# EAGLE board gf12_v2 (EAGLE 9.5.2)
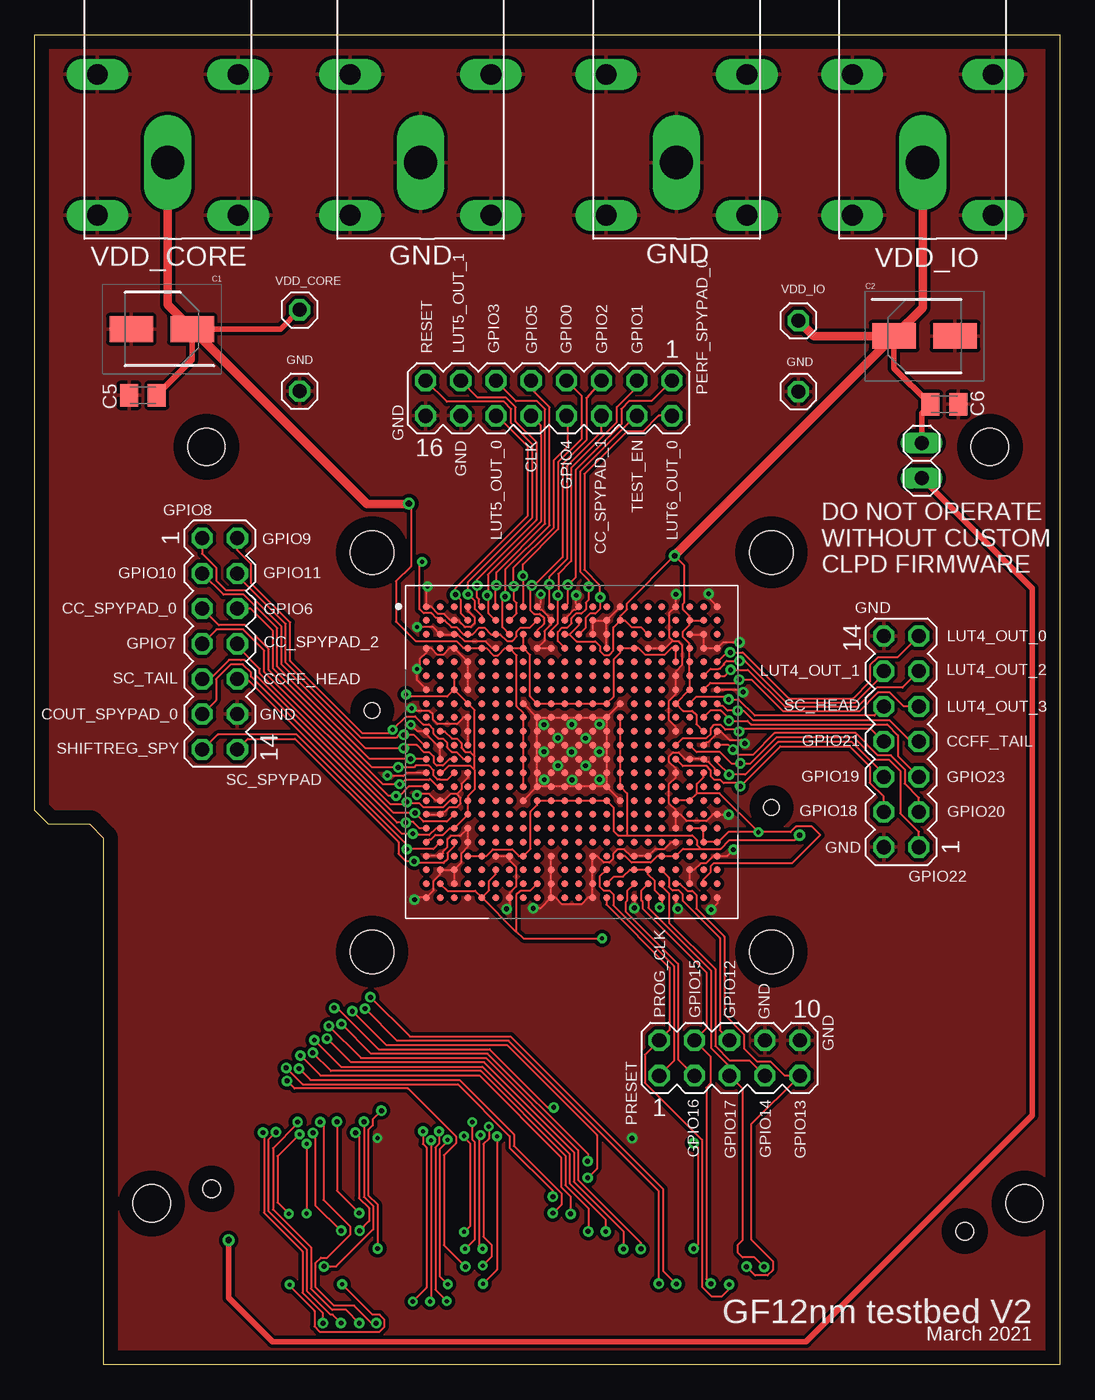
[diagram p3: board, top side]
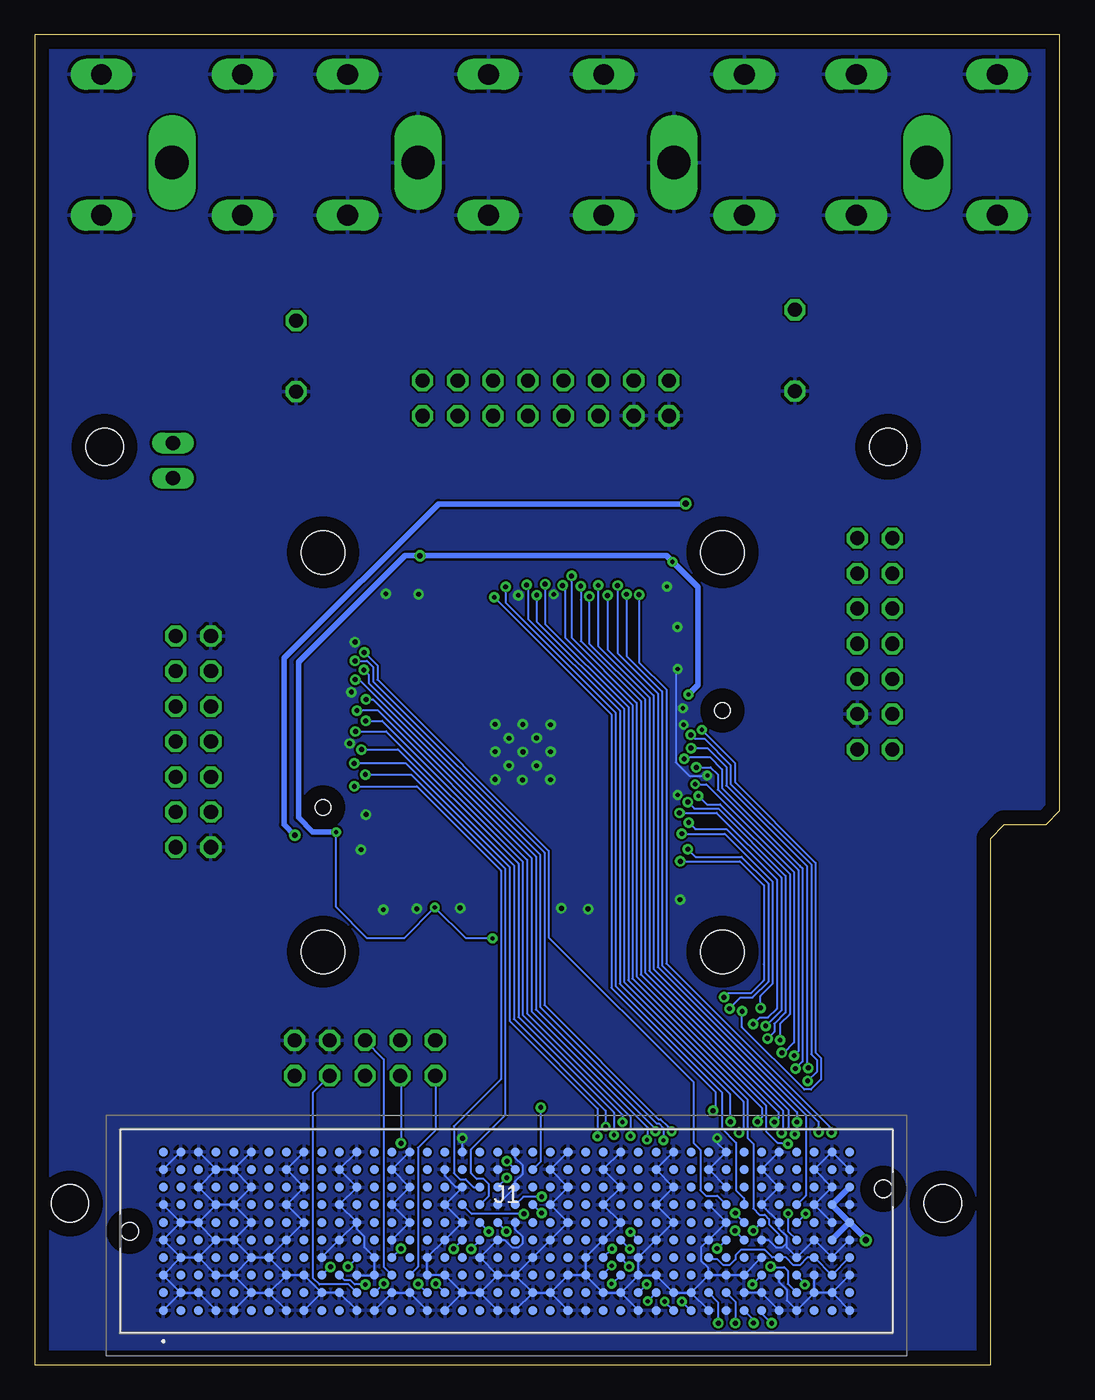
[diagram p4: board, bottom side, seen from below]

Size 74 x 96 mm. Coordinates in mm from the lower left corner, seen from the top.
Outline: 5,0 5,38 4,39 1,39 0,40 0,96 74,96 74,0 5,0
Copper layers (1*16): Top 0.035mm / dielectric 1.5mm / Bottom 0.035mm
Design rules "default *": minimum track width 6mil, minimum drill 0.3mm, track to track 6mil, track to pad 6mil, pad to pad 6mil, via to via 6mil, smd to smd 6mil, copper to edge 40mil, drill to drill 6mil, minimum pad ring 8mil, minimum via ring 8mil, stop-mask expansion 4mil, vias tented up to drill 0mil, thermal gap 10mil
Holes 2.7 mm at 8.45,11.65 71.45,11.65 68.95,66.25 12.4,66.25
Holes 3.15 mm at 24.36,58.63 24.36,29.82 53.19,58.63 53.19,29.82
Holes 1.12 mm at 24.36,47.23 53.19,40.23

## Footprints (pad centres in the part's own frame; a part is rotated, then mirrored left to right if it is on the bottom)
CAPAE530X610N = smd 3.15 x 1.85: 1 -2.2,0; 2 2.2,0
C0805K = smd 1.3 x 1.6: 1 -1,0; 2 1,0
1X01 = drill 1.016 octagon: 1 0,0
ASP13448801 = smd 0.64 x 0.64: A1 24.765,5.715; A2 23.495,5.715; A3 22.225,5.715; A4 20.955,5.715; A5 19.685,5.715; A6 18.415,5.715; A7 17.145,5.715; A8 15.875,5.715; A9 14.605,5.715; A10 13.335,5.715; A11 12.065,5.715; A12 10.795,5.715; A13 9.525,5.715; A14 8.255,5.715; A15 6.985,5.715; A16 5.715,5.715; A17 4.445,5.715; A18 3.175,5.715; A19 1.905,5.715; A20 0.635,5.715; A21 -0.635,5.715; A22 -1.905,5.715; A23 -3.175,5.715; A24 -4.445,5.715; A25 -5.715,5.715; A26 -6.985,5.715; A27 -8.255,5.715; A28 -9.525,5.715; A29 -10.795,5.715; A30 -12.065,5.715; A31 -13.335,5.715; A32 -14.605,5.715; A33 -15.875,5.715; A34 -17.145,5.715; A35 -18.415,5.715; A36 -19.685,5.715; A37 -20.955,5.715; A38 -22.225,5.715; A39 -23.495,5.715; A40 -24.765,5.715; B1 24.765,4.445; B2 23.495,4.445; B3 22.225,4.445; B4 20.955,4.445; B5 19.685,4.445; B6 18.415,4.445; B7 17.145,4.445; B8 15.875,4.445; B9 14.605,4.445; B10 13.335,4.445; B11 12.065,4.445; B12 10.795,4.445; B13 9.525,4.445; B14 8.255,4.445; B15 6.985,4.445; B16 5.715,4.445; B17 4.445,4.445; B18 3.175,4.445; B19 1.905,4.445; B20 0.635,4.445; B21 -0.635,4.445; B22 -1.905,4.445; B23 -3.175,4.445; B24 -4.445,4.445; B25 -5.715,4.445; B26 -6.985,4.445; B27 -8.255,4.445; B28 -9.525,4.445; B29 -10.795,4.445; B30 -12.065,4.445; B31 -13.335,4.445; B32 -14.605,4.445; B33 -15.875,4.445; B34 -17.145,4.445; B35 -18.415,4.445; B36 -19.685,4.445; B37 -20.955,4.445; B38 -22.225,4.445; B39 -23.495,4.445; B40 -24.765,4.445; C1 24.765,3.175; C2 23.495,3.175; C3 22.225,3.175; C4 20.955,3.175; C5 19.685,3.175; C6 18.415,3.175; C7 17.145,3.175; C8 15.875,3.175; C9 14.605,3.175; C10 13.335,3.175; C11 12.065,3.175; C12 10.795,3.175; C13 9.525,3.175; C14 8.255,3.175; C15 6.985,3.175; C16 5.715,3.175; C17 4.445,3.175; C18 3.175,3.175; C19 1.905,3.175; C20 0.635,3.175; C21 -0.635,3.175; C22 -1.905,3.175; C23 -3.175,3.175; C24 -4.445,3.175; C25 -5.715,3.175; C26 -6.985,3.175; C27 -8.255,3.175; C28 -9.525,3.175; C29 -10.795,3.175; C30 -12.065,3.175; C31 -13.335,3.175; C32 -14.605,3.175; C33 -15.875,3.175; C34 -17.145,3.175; C35 -18.415,3.175; C36 -19.685,3.175; C37 -20.955,3.175; C38 -22.225,3.175; C39 -23.495,3.175; C40 -24.765,3.175; D1 24.765,1.905; D2 23.495,1.905; D3 22.225,1.905; D4 20.955,1.905; D5 19.685,1.905; D6 18.415,1.905; D7 17.145,1.905; D8 15.875,1.905; D9 14.605,1.905; D10 13.335,1.905; D11 12.065,1.905; D12 10.795,1.905; D13 9.525,1.905; D14 8.255,1.905; D15 6.985,1.905; D16 5.715,1.905; D17 4.445,1.905; D18 3.175,1.905; D19 1.905,1.905; D20 0.635,1.905; D21 -0.635,1.905; D22 -1.905,1.905; D23 -3.175,1.905; D24 -4.445,1.905; D25 -5.715,1.905; D26 -6.985,1.905; D27 -8.255,1.905; D28 -9.525,1.905; D29 -10.795,1.905; D30 -12.065,1.905; D31 -13.335,1.905; D32 -14.605,1.905; D33 -15.875,1.905; D34 -17.145,1.905; D35 -18.415,1.905; D36 -19.685,1.905; D37 -20.955,1.905; D38 -22.225,1.905; D39 -23.495,1.905; D40 -24.765,1.905; E1 24.765,0.635; E2 23.495,0.635; E3 22.225,0.635; E4 20.955,0.635; E5 19.685,0.635; E6 18.415,0.635; E7 17.145,0.635; E8 15.875,0.635; E9 14.605,0.635; E10 13.335,0.635; E11 12.065,0.635; E12 10.795,0.635; E13 9.525,0.635; E14 8.255,0.635; E15 6.985,0.635; E16 5.715,0.635; E17 4.445,0.635; E18 3.175,0.635; E19 1.905,0.635; E20 0.635,0.635; E21 -0.635,0.635; E22 -1.905,0.635; E23 -3.175,0.635; E24 -4.445,0.635; E25 -5.715,0.635; E26 -6.985,0.635; E27 -8.255,0.635; E28 -9.525,0.635; E29 -10.795,0.635; E30 -12.065,0.635; E31 -13.335,0.635; E32 -14.605,0.635; E33 -15.875,0.635; E34 -17.145,0.635; E35 -18.415,0.635; E36 -19.685,0.635; E37 -20.955,0.635; E38 -22.225,0.635; E39 -23.495,0.635; E40 -24.765,0.635; F1 24.765,-0.635; F2 23.495,-0.635; F3 22.225,-0.635; F4 20.955,-0.635; F5 19.685,-0.635; F6 18.415,-0.635; F7 17.145,-0.635; F8 15.875,-0.635; F9 14.605,-0.635; F10 13.335,-0.635; F11 12.065,-0.635; F12 10.795,-0.635; F13 9.525,-0.635; F14 8.255,-0.635; F15 6.985,-0.635; F16 5.715,-0.635; F17 4.445,-0.635; F18 3.175,-0.635; F19 1.905,-0.635; F20 0.635,-0.635; F21 -0.635,-0.635; F22 -1.905,-0.635; F23 -3.175,-0.635; F24 -4.445,-0.635; F25 -5.715,-0.635; F26 -6.985,-0.635; F27 -8.255,-0.635; F28 -9.525,-0.635; F29 -10.795,-0.635; F30 -12.065,-0.635; F31 -13.335,-0.635; F32 -14.605,-0.635; F33 -15.875,-0.635; F34 -17.145,-0.635; F35 -18.415,-0.635; F36 -19.685,-0.635; F37 -20.955,-0.635; F38 -22.225,-0.635; F39 -23.495,-0.635; F40 -24.765,-0.635; G1 24.765,-1.905; G2 23.495,-1.905; G3 22.225,-1.905; G4 20.955,-1.905; G5 19.685,-1.905; G6 18.415,-1.905; G7 17.145,-1.905; G8 15.875,-1.905; G9 14.605,-1.905; G10 13.335,-1.905; G11 12.065,-1.905; G12 10.795,-1.905; G13 9.525,-1.905; G14 8.255,-1.905; G15 6.985,-1.905; G16 5.715,-1.905; G17 4.445,-1.905; G18 3.175,-1.905; G19 1.905,-1.905; G20 0.635,-1.905; G21 -0.635,-1.905; G22 -1.905,-1.905; G23 -3.175,-1.905; G24 -4.445,-1.905; G25 -5.715,-1.905; G26 -6.985,-1.905; G27 -8.255,-1.905; G28 -9.525,-1.905; G29 -10.795,-1.905; G30 -12.065,-1.905; G31 -13.335,-1.905; G32 -14.605,-1.905; G33 -15.875,-1.905; G34 -17.145,-1.905; G35 -18.415,-1.905; G36 -19.685,-1.905; G37 -20.955,-1.905; G38 -22.225,-1.905; G39 -23.495,-1.905; G40 -24.765,-1.905; H1 24.765,-3.175; H2 23.495,-3.175; H3 22.225,-3.175; H4 20.955,-3.175; H5 19.685,-3.175; H6 18.415,-3.175; H7 17.145,-3.175; H8 15.875,-3.175; H9 14.605,-3.175; H10 13.335,-3.175; H11 12.065,-3.175; H12 10.795,-3.175; H13 9.525,-3.175; H14 8.255,-3.175; H15 6.985,-3.175; H16 5.715,-3.175; H17 4.445,-3.175; H18 3.175,-3.175; H19 1.905,-3.175; H20 0.635,-3.175; H21 -0.635,-3.175; H22 -1.905,-3.175; H23 -3.175,-3.175; H24 -4.445,-3.175; H25 -5.715,-3.175; H26 -6.985,-3.175; H27 -8.255,-3.175; H28 -9.525,-3.175; H29 -10.795,-3.175; H30 -12.065,-3.175; H31 -13.335,-3.175; H32 -14.605,-3.175; H33 -15.875,-3.175; H34 -17.145,-3.175; H35 -18.415,-3.175; H36 -19.685,-3.175; H37 -20.955,-3.175; H38 -22.225,-3.175; H39 -23.495,-3.175; H40 -24.765,-3.175; J1 24.765,-4.445; J2 23.495,-4.445; J3 22.225,-4.445; J4 20.955,-4.445; J5 19.685,-4.445; J6 18.415,-4.445; J7 17.145,-4.445; J8 15.875,-4.445; J9 14.605,-4.445; J10 13.335,-4.445; J11 12.065,-4.445; J12 10.795,-4.445; J13 9.525,-4.445; J14 8.255,-4.445; J15 6.985,-4.445; J16 5.715,-4.445; J17 4.445,-4.445; J18 3.175,-4.445; J19 1.905,-4.445; J20 0.635,-4.445; J21 -0.635,-4.445; J22 -1.905,-4.445; J23 -3.175,-4.445; J24 -4.445,-4.445; J25 -5.715,-4.445; J26 -6.985,-4.445; J27 -8.255,-4.445; J28 -9.525,-4.445; J29 -10.795,-4.445; J30 -12.065,-4.445; J31 -13.335,-4.445; J32 -14.605,-4.445; J33 -15.875,-4.445; J34 -17.145,-4.445; J35 -18.415,-4.445; J36 -19.685,-4.445; J37 -20.955,-4.445; J38 -22.225,-4.445; J39 -23.495,-4.445; J40 -24.765,-4.445; K1 24.765,-5.715; K2 23.495,-5.715; K3 22.225,-5.715; K4 20.955,-5.715; K5 19.685,-5.715; K6 18.415,-5.715; K7 17.145,-5.715; K8 15.875,-5.715; K9 14.605,-5.715; K10 13.335,-5.715; K11 12.065,-5.715; K12 10.795,-5.715; K13 9.525,-5.715; K14 8.255,-5.715; K15 6.985,-5.715; K16 5.715,-5.715; K17 4.445,-5.715; K18 3.175,-5.715; K19 1.905,-5.715; K20 0.635,-5.715; K21 -0.635,-5.715; K22 -1.905,-5.715; K23 -3.175,-5.715; K24 -4.445,-5.715; K25 -5.715,-5.715; K26 -6.985,-5.715; K27 -8.255,-5.715; K28 -9.525,-5.715; K29 -10.795,-5.715; K30 -12.065,-5.715; K31 -13.335,-5.715; K32 -14.605,-5.715; K33 -15.875,-5.715; K34 -17.145,-5.715; K35 -18.415,-5.715; K36 -19.685,-5.715; K37 -20.955,-5.715; K38 -22.225,-5.715; K39 -23.495,-5.715; K40 -24.765,-5.715 | hole 1.27: 27.189,0; -27.191,-3.05
1X02 = drill 1.016 long: 1 -1.27,0; 2 1.27,0
MA08-2 = drill 1.016 octagon: 1 -8.89,-1.27; 2 -8.89,1.27; 3 -6.35,-1.27; 4 -6.35,1.27; 5 -3.81,-1.27; 6 -3.81,1.27; 7 -1.27,-1.27; 8 -1.27,1.27; 9 1.27,-1.27; 10 1.27,1.27; 11 3.81,-1.27; 12 3.81,1.27; 13 6.35,-1.27; 14 6.35,1.27; 15 8.89,-1.27; 16 8.89,1.27
MA07-2 = drill 1.016 octagon: 1 -7.62,-1.27; 2 -7.62,1.27; 3 -5.08,-1.27; 4 -5.08,1.27; 5 -2.54,-1.27; 6 -2.54,1.27; 7 0,-1.27; 8 0,1.27; 9 2.54,-1.27; 10 2.54,1.27; 11 5.08,-1.27; 12 5.08,1.27; 13 7.62,-1.27; 14 7.62,1.27
MA05-2 = drill 1.016 octagon: 1 -5.08,-1.27; 2 -5.08,1.27; 3 -2.54,-1.27; 4 -2.54,1.27; 5 0,-1.27; 6 0,1.27; 7 2.54,-1.27; 8 2.54,1.27; 9 5.08,-1.27; 10 5.08,1.27
BGA484C100P22X22_2400X2400X220N = smd 0.5 x 0.5: A1 -10.5,10.5; A2 -9.5,10.5; A3 -8.5,10.5; A4 -7.5,10.5; A5 -6.5,10.5; A6 -5.5,10.5; A7 -4.5,10.5; A8 -3.5,10.5; A9 -2.5,10.5; A10 -1.5,10.5; A11 -0.5,10.5; A12 0.5,10.5; A13 1.5,10.5; A14 2.5,10.5; A15 3.5,10.5; A16 4.5,10.5; A17 5.5,10.5; A18 6.5,10.5; A19 7.5,10.5; A20 8.5,10.5; A21 9.5,10.5; A22 10.5,10.5; AA1 -10.5,-9.5; AA2 -9.5,-9.5; AA3 -8.5,-9.5; AA4 -7.5,-9.5; AA5 -6.5,-9.5; AA6 -5.5,-9.5; AA7 -4.5,-9.5; AA8 -3.5,-9.5; AA9 -2.5,-9.5; AA10 -1.5,-9.5; AA11 -0.5,-9.5; AA12 0.5,-9.5; AA13 1.5,-9.5; AA14 2.5,-9.5; AA15 3.5,-9.5; AA16 4.5,-9.5; AA17 5.5,-9.5; AA18 6.5,-9.5; AA19 7.5,-9.5; AA20 8.5,-9.5; AA21 9.5,-9.5; AA22 10.5,-9.5; AB1 -10.5,-10.5; AB2 -9.5,-10.5; AB3 -8.5,-10.5; AB4 -7.5,-10.5; AB5 -6.5,-10.5; AB6 -5.5,-10.5; AB7 -4.5,-10.5; AB8 -3.5,-10.5; AB9 -2.5,-10.5; AB10 -1.5,-10.5; AB11 -0.5,-10.5; AB12 0.5,-10.5; AB13 1.5,-10.5; AB14 2.5,-10.5; AB15 3.5,-10.5; AB16 4.5,-10.5; AB17 5.5,-10.5; AB18 6.5,-10.5; AB19 7.5,-10.5; AB20 8.5,-10.5; AB21 9.5,-10.5; AB22 10.5,-10.5; B1 -10.5,9.5; B2 -9.5,9.5; B3 -8.5,9.5; B4 -7.5,9.5; B5 -6.5,9.5; B6 -5.5,9.5; B7 -4.5,9.5; B8 -3.5,9.5; B9 -2.5,9.5; B10 -1.5,9.5; B11 -0.5,9.5; B12 0.5,9.5; B13 1.5,9.5; B14 2.5,9.5; B15 3.5,9.5; B16 4.5,9.5; B17 5.5,9.5; B18 6.5,9.5; B19 7.5,9.5; B20 8.5,9.5; B21 9.5,9.5; B22 10.5,9.5; C1 -10.5,8.5; C2 -9.5,8.5; C3 -8.5,8.5; C4 -7.5,8.5; C5 -6.5,8.5; C6 -5.5,8.5; C7 -4.5,8.5; C8 -3.5,8.5; C9 -2.5,8.5; C10 -1.5,8.5; C11 -0.5,8.5; C12 0.5,8.5; C13 1.5,8.5; C14 2.5,8.5; C15 3.5,8.5; C16 4.5,8.5; C17 5.5,8.5; C18 6.5,8.5; C19 7.5,8.5; C20 8.5,8.5; C21 9.5,8.5; C22 10.5,8.5; D1 -10.5,7.5; D2 -9.5,7.5; D3 -8.5,7.5; D4 -7.5,7.5; D5 -6.5,7.5; D6 -5.5,7.5; D7 -4.5,7.5; D8 -3.5,7.5; D9 -2.5,7.5; D10 -1.5,7.5; D11 -0.5,7.5; D12 0.5,7.5; D13 1.5,7.5; D14 2.5,7.5; D15 3.5,7.5; D16 4.5,7.5; D17 5.5,7.5; D18 6.5,7.5; D19 7.5,7.5; D20 8.5,7.5; D21 9.5,7.5; D22 10.5,7.5; E1 -10.5,6.5; E2 -9.5,6.5; E3 -8.5,6.5; E4 -7.5,6.5; E5 -6.5,6.5; E6 -5.5,6.5; E7 -4.5,6.5; E8 -3.5,6.5; E9 -2.5,6.5; E10 -1.5,6.5; E11 -0.5,6.5; E12 0.5,6.5; E13 1.5,6.5; E14 2.5,6.5; E15 3.5,6.5; E16 4.5,6.5; E17 5.5,6.5; E18 6.5,6.5; E19 7.5,6.5; E20 8.5,6.5; E21 9.5,6.5; E22 10.5,6.5; F1 -10.5,5.5; F2 -9.5,5.5; F3 -8.5,5.5; F4 -7.5,5.5; F5 -6.5,5.5; F6 -5.5,5.5; F7 -4.5,5.5; F8 -3.5,5.5; F9 -2.5,5.5; F10 -1.5,5.5; F11 -0.5,5.5; F12 0.5,5.5; F13 1.5,5.5; F14 2.5,5.5; F15 3.5,5.5; F16 4.5,5.5; F17 5.5,5.5; F18 6.5,5.5; F19 7.5,5.5; F20 8.5,5.5; F21 9.5,5.5; F22 10.5,5.5; G1 -10.5,4.5; G2 -9.5,4.5; G3 -8.5,4.5; G4 -7.5,4.5; G5 -6.5,4.5; G6 -5.5,4.5; G7 -4.5,4.5; G8 -3.5,4.5; G9 -2.5,4.5; G10 -1.5,4.5; G11 -0.5,4.5; G12 0.5,4.5; G13 1.5,4.5; G14 2.5,4.5; G15 3.5,4.5; G16 4.5,4.5; G17 5.5,4.5; G18 6.5,4.5; G19 7.5,4.5; G20 8.5,4.5; G21 9.5,4.5; G22 10.5,4.5; H1 -10.5,3.5; H2 -9.5,3.5; H3 -8.5,3.5; H4 -7.5,3.5; H5 -6.5,3.5; H6 -5.5,3.5; H7 -4.5,3.5; H8 -3.5,3.5; H9 -2.5,3.5; H10 -1.5,3.5; H11 -0.5,3.5; H12 0.5,3.5; H13 1.5,3.5; H14 2.5,3.5; H15 3.5,3.5; H16 4.5,3.5; H17 5.5,3.5; H18 6.5,3.5; H19 7.5,3.5; H20 8.5,3.5; H21 9.5,3.5; H22 10.5,3.5; J1 -10.5,2.5; J2 -9.5,2.5; J3 -8.5,2.5; J4 -7.5,2.5; J5 -6.5,2.5; J6 -5.5,2.5; J7 -4.5,2.5; J8 -3.5,2.5; J9 -2.5,2.5; J10 -1.5,2.5; J11 -0.5,2.5; J12 0.5,2.5; J13 1.5,2.5; J14 2.5,2.5; J15 3.5,2.5; J16 4.5,2.5; J17 5.5,2.5; J18 6.5,2.5; J19 7.5,2.5; J20 8.5,2.5; J21 9.5,2.5; J22 10.5,2.5; K1 -10.5,1.5; K2 -9.5,1.5; K3 -8.5,1.5; K4 -7.5,1.5; K5 -6.5,1.5; K6 -5.5,1.5; K7 -4.5,1.5; K8 -3.5,1.5; K9 -2.5,1.5; K10 -1.5,1.5; K11 -0.5,1.5; K12 0.5,1.5; K13 1.5,1.5; K14 2.5,1.5; K15 3.5,1.5; K16 4.5,1.5; K17 5.5,1.5; K18 6.5,1.5; K19 7.5,1.5; K20 8.5,1.5; K21 9.5,1.5; K22 10.5,1.5; L1 -10.5,0.5; L2 -9.5,0.5; L3 -8.5,0.5; L4 -7.5,0.5; L5 -6.5,0.5; L6 -5.5,0.5; L7 -4.5,0.5; L8 -3.5,0.5; L9 -2.5,0.5; L10 -1.5,0.5; L11 -0.5,0.5; L12 0.5,0.5; L13 1.5,0.5; L14 2.5,0.5; L15 3.5,0.5; L16 4.5,0.5; L17 5.5,0.5; L18 6.5,0.5; L19 7.5,0.5; L20 8.5,0.5; L21 9.5,0.5; L22 10.5,0.5; M1 -10.5,-0.5; M2 -9.5,-0.5; M3 -8.5,-0.5; M4 -7.5,-0.5; M5 -6.5,-0.5; M6 -5.5,-0.5; M7 -4.5,-0.5; M8 -3.5,-0.5; M9 -2.5,-0.5; M10 -1.5,-0.5; M11 -0.5,-0.5; M12 0.5,-0.5; M13 1.5,-0.5; M14 2.5,-0.5; M15 3.5,-0.5; M16 4.5,-0.5; M17 5.5,-0.5; M18 6.5,-0.5; M19 7.5,-0.5; M20 8.5,-0.5; M21 9.5,-0.5; M22 10.5,-0.5; N1 -10.5,-1.5; N2 -9.5,-1.5; N3 -8.5,-1.5; N4 -7.5,-1.5; N5 -6.5,-1.5; N6 -5.5,-1.5; N7 -4.5,-1.5; N8 -3.5,-1.5; N9 -2.5,-1.5; N10 -1.5,-1.5; N11 -0.5,-1.5; N12 0.5,-1.5; N13 1.5,-1.5; N14 2.5,-1.5; N15 3.5,-1.5; N16 4.5,-1.5; N17 5.5,-1.5; N18 6.5,-1.5; N19 7.5,-1.5; N20 8.5,-1.5; N21 9.5,-1.5; N22 10.5,-1.5; P1 -10.5,-2.5; P2 -9.5,-2.5; P3 -8.5,-2.5; P4 -7.5,-2.5; P5 -6.5,-2.5; P6 -5.5,-2.5; P7 -4.5,-2.5; P8 -3.5,-2.5; P9 -2.5,-2.5; P10 -1.5,-2.5; P11 -0.5,-2.5; P12 0.5,-2.5; P13 1.5,-2.5; P14 2.5,-2.5; P15 3.5,-2.5; P16 4.5,-2.5; P17 5.5,-2.5; P18 6.5,-2.5; P19 7.5,-2.5; P20 8.5,-2.5; P21 9.5,-2.5; P22 10.5,-2.5; R1 -10.5,-3.5; R2 -9.5,-3.5; R3 -8.5,-3.5; R4 -7.5,-3.5; R5 -6.5,-3.5; R6 -5.5,-3.5; R7 -4.5,-3.5; R8 -3.5,-3.5; R9 -2.5,-3.5; R10 -1.5,-3.5; R11 -0.5,-3.5; R12 0.5,-3.5; R13 1.5,-3.5; R14 2.5,-3.5; R15 3.5,-3.5; R16 4.5,-3.5; R17 5.5,-3.5; R18 6.5,-3.5; R19 7.5,-3.5; R20 8.5,-3.5; R21 9.5,-3.5; R22 10.5,-3.5; T1 -10.5,-4.5; T2 -9.5,-4.5; T3 -8.5,-4.5; T4 -7.5,-4.5; T5 -6.5,-4.5; T6 -5.5,-4.5; T7 -4.5,-4.5; T8 -3.5,-4.5; T9 -2.5,-4.5; T10 -1.5,-4.5; T11 -0.5,-4.5; T12 0.5,-4.5; T13 1.5,-4.5; T14 2.5,-4.5; T15 3.5,-4.5; T16 4.5,-4.5; T17 5.5,-4.5; T18 6.5,-4.5; T19 7.5,-4.5; T20 8.5,-4.5; T21 9.5,-4.5; T22 10.5,-4.5; U1 -10.5,-5.5; U2 -9.5,-5.5; U3 -8.5,-5.5; U4 -7.5,-5.5; U5 -6.5,-5.5; U6 -5.5,-5.5; U7 -4.5,-5.5; U8 -3.5,-5.5; U9 -2.5,-5.5; U10 -1.5,-5.5; U11 -0.5,-5.5; U12 0.5,-5.5; U13 1.5,-5.5; U14 2.5,-5.5; U15 3.5,-5.5; U16 4.5,-5.5; U17 5.5,-5.5; U18 6.5,-5.5; U19 7.5,-5.5; U20 8.5,-5.5; U21 9.5,-5.5; U22 10.5,-5.5; V1 -10.5,-6.5; V2 -9.5,-6.5; V3 -8.5,-6.5; V4 -7.5,-6.5; V5 -6.5,-6.5; V6 -5.5,-6.5; V7 -4.5,-6.5; V8 -3.5,-6.5; V9 -2.5,-6.5; V10 -1.5,-6.5; V11 -0.5,-6.5; V12 0.5,-6.5; V13 1.5,-6.5; V14 2.5,-6.5; V15 3.5,-6.5; V16 4.5,-6.5; V17 5.5,-6.5; V18 6.5,-6.5; V19 7.5,-6.5; V20 8.5,-6.5; V21 9.5,-6.5; V22 10.5,-6.5; W1 -10.5,-7.5; W2 -9.5,-7.5; W3 -8.5,-7.5; W4 -7.5,-7.5; W5 -6.5,-7.5; W6 -5.5,-7.5; W7 -4.5,-7.5; W8 -3.5,-7.5; W9 -2.5,-7.5; W10 -1.5,-7.5; W11 -0.5,-7.5; W12 0.5,-7.5; W13 1.5,-7.5; W14 2.5,-7.5; W15 3.5,-7.5; W16 4.5,-7.5; W17 5.5,-7.5; W18 6.5,-7.5; W19 7.5,-7.5; W20 8.5,-7.5; W21 9.5,-7.5; W22 10.5,-7.5; Y1 -10.5,-8.5; Y2 -9.5,-8.5; Y3 -8.5,-8.5; Y4 -7.5,-8.5; Y5 -6.5,-8.5; Y6 -5.5,-8.5; Y7 -4.5,-8.5; Y8 -3.5,-8.5; Y9 -2.5,-8.5; Y10 -1.5,-8.5; Y11 -0.5,-8.5; Y12 0.5,-8.5; Y13 1.5,-8.5; Y14 2.5,-8.5; Y15 3.5,-8.5; Y16 4.5,-8.5; Y17 5.5,-8.5; Y18 6.5,-8.5; Y19 7.5,-8.5; Y20 8.5,-8.5; Y21 9.5,-8.5; Y22 10.5,-8.5
73099 = drill 2.4 long: P$1 6,5.5 | drill 1.5 long: P$2 11.08,11.86; P$3 0.92,11.86; P$4 0.92,1.7; P$5 11.08,1.7

## Placement (x,y rotation side)
C1  APXT160ARA101ME61G  [CAPAE530X610N]  9.18,74.75 180 top
C2  APXT160ARA101ME61G  [CAPAE530X610N]  64.23,74.25 0 top
C5  [C0805K]  7.81,69.97 180 top
C6  [C0805K]  65.66,69.32 0 top
GND  [1X01]  19.13,70.28 90 top
GND_IO  [1X01]  55.13,70.25 90 top
J1  ASP-134488-01  [ASP13448801]  39.95,9.65 180 bottom
JP1  [1X02]  64.02,65.26 90 top
SV1  [MA08-2]  37.11,69.76 180 top
SV2  [MA07-2]  62.55,44.98 90 top
SV3  [MA07-2]  13.36,52.04 270 top
SV4  [MA05-2]  50.16,22.14 0 top
U$2  BGA352  [BGA484C100P22X22_2400X2400X220N]  38.77,44.23 0 top
U$3  BANANA_JACK  [73099]  40.33,81.27 0 top
U$4  BANANA_JACK  [73099]  58.09,81.27 0 top
U$5  BANANA_JACK  [73099]  21.85,81.27 0 top
VDD  BANANA_JACK  [73099]  3.61,81.27 0 top
VDD_CORE  [1X01]  19.13,76.14 90 top
VDD_IO  [1X01]  55.13,75.36 90 top

## Tracks (layer width: path | path; a pad name or v marks a point on that pad's centre or on a via)
3V3_CARRIER
  Bottom 0.152: J1.D40 J1.C39 J1.D38 18.22,7.75 18.77,7.2 19.22,7.2 19.77,7.75 J1.D36 20.76,7.75 21.31,8.29 23.03,8.29 23.42,7.91 23.42,7.61 23.43,7.61 23.85,7.2 24.3,7.2 24.72,7.61 25.21,7.61 J1.D32
12V_CARRIER  (via drill 0.3)
  Top 0.152: v18.4,5.79 18.4,5.69 20.19,3.9 20.19,2.77 20.56,2.4 24.9,2.4 25.26,2.76 25.26,3.26 24.9,3.62 24.39,3.62 v22.2,5.81 v22.2,5.8
  Bottom 0.152: J1.C37 18.4,5.88 v18.4,5.79 | v22.2,5.8 21.54,6.46 J1.C35
B48_L4_N  (via drill 0.35)
  Top 0.152: U$2.C10 37.27,52.99 37.77,53.49 v37.77,55.54 v37.77,55.55 37.8,55.59 37.8,57.09 38.73,58.01 38.73,64.72 42.03,68.02 42.03,69.12 43.46,70.55 SV1.3 | v23.16,16.75 23.42,16.49 23.42,12.03 24.12,11.32 24.12,10.34 24.11,10.34 v23.45,9.68
  Bottom 0.152: v37.77,55.55 37.77,53.66 31.46,47.35 31.46,27.62 22.86,19.01 22.86,17.05 v23.16,16.75 | J1.E34 22.8,9.04 v23.45,9.68
B48_L4_P  (via drill 0.35)
  Top 0.152: U$2.C12 39.78,53.23 39.78,53.92 40.08,54.22 40.47,54.22 40.79,54.54 40.79,55.36 v40.82,55.39 40.82,56.24 39.67,57.39 39.67,64.29 42.75,67.37 43.91,67.37 45.03,68.49 SV1.2 | v25.04,18.34 24.41,17.71 24.41,17.27 24.08,16.94 24.08,12.25 24.73,11.6 24.73,8.4 v24.75,8.39
  Bottom 0.152: v40.82,55.39 32.38,46.95 32.38,27.21 24.88,19.71 24.88,18.5 v25.04,18.34 | v24.75,8.39 24.7,8.39 J1.E33
B48_L9_N  (via drill 0.35)
  Top 0.152: U$2.C7 33.76,53.24 33.76,55.25 v33.96,55.46 33.96,57.39 37.16,60.59 37.16,69.12 35.84,70.44 SV1.9 | v22.13,9.68 22.1,9.68 20.26,11.52 20.26,16.57 v20.09,16.74
  Bottom 0.152: v33.96,55.46 33.97,55.45 33.97,52.08 29.94,48.04 29.94,28.31 20,18.37 20,16.83 v20.09,16.74 | v22.13,9.68 v22.14,9.69 J1.F35
B48_L9_P  (via drill 0.35)
  Top 0.152: U$2.C9 36.27,52.98 36.76,53.47 36.76,53.8 36.75,53.81 36.75,53.92 36.47,54.2 36.08,54.2 36.07,54.2 36.04,54.2 35.77,54.47 35.77,56.13 v35.89,56.25 36.06,56.25 38.1,58.29 38.1,65.01 39.82,66.73 39.82,69.77 SV1.5 | v21.83,17.55 21.83,12.56 v23.43,10.96
  Bottom 0.152: v35.89,56.25 35.71,56.07 35.71,52.49 30.85,47.63 30.85,27.88 21.52,18.55 21.52,17.85 v21.83,17.55 | v23.43,10.96 23.43,10.91 J1.F34
B48_L10_N  (via drill 0.3, 0.35)
  Top 0.152: U$2.A8 35.27,56.93 v35.25,56.93 35.25,57.77 37.79,60.31 37.79,65.16 39.49,66.86 39.49,69.92 SV1.7 | v19.64,15.94 19.64,10.94 v19.62,10.92
  Bottom 0.152: v35.25,56.93 35.25,52.48 30.55,47.78 30.55,28.04 21.22,18.71 21.22,16.87 20.39,16.04 19.73,16.04 v19.64,15.94 | v19.62,10.92 19.62,9.64 J1.E37
B48_L10_P  (via drill 0.35)
  Top 0.152: U$2.A10 37.15,54.85 v37.15,56.34 37.15,56.88 38.41,58.14 38.41,64.86 40.92,67.37 SV1.6
  Bottom 0.152: v37.15,56.34 37.15,53.48 31.16,47.49 31.16,27.76 22.55,19.15 22.55,16.37 22.14,15.96 22.14,11.28 21.69,10.83 21.31,10.83 20.99,10.51 20.99,10.13 20.27,9.4 J1.E36
B48_L12_P  (via drill 0.3, 0.35)
  Top 0.152: U$2.A6 33.27,56.2 v33.33,56.26 33.33,57.19 36.85,60.71 36.85,68.96 36.26,69.55 34.73,69.55 33.3,70.98 SV1.11 | v19.13,16.65 17.54,15.06 17.54,11.72 v18.35,10.91
  Bottom 0.152: v33.33,56.26 33.33,51.87 29.63,48.17 29.63,28.44 19.61,18.41 19.61,17.13 v19.13,16.65 | J1.F37 19,10.27 v18.35,10.91
B64_L1_N  (via drill 0.35)
  Top 0.152: U$2.AB14 41.27,33.72 41.27,33.22 45.83,28.65 45.83,24.16 SV4.2 44.05,22.38 44.05,20.36 48.17,16.24 48.17,5.62 48.83,4.96 49.62,4.96 50.13,5.47 v50.13,5.8
  Bottom 0.152: v50.13,5.8 50.91,5.8 51.21,6.11 51.65,6.11 J1.C11
B64_L1_P  (via drill 0.35)
  Top 0.152: U$2.AB17 44.28,33.72 44.28,32.99 48.82,28.45 48.82,22.88 50.16,21.54 SV4.5 51.1,19.93 51.1,9.02 50.77,8.68 50.77,8.07 51.09,7.75 51.96,7.75 v52.64,7.07
  Bottom 0.152: v52.64,7.07 52.69,7.07 J1.C10
B64_L3_N  (via drill 0.35)
  Top 0.152: U$2.AA19 46.59,34.73 47.11,34.2 47.47,34.2 47.76,33.92 47.76,32.93 49.77,30.92 49.77,25.28 51.2,23.85 51.2,22.85 52.17,21.88 53.14,21.88 54.15,20.87 SV4.9 51.72,17.34 51.72,9.04 53.27,7.49 53.27,6.83 52.9,6.46 52,6.46 v51.38,7.08
  Bottom 0.152: v51.38,7.08 50.74,7.71 J1.D12
B64_L5_N
  Top 0.152: U$2.Y18 45.27,35.66 45.77,35.16 45.77,34.49 46.05,34.23 46.52,34.23 46.76,33.98 46.76,33.5 49.46,30.8 49.46,24.14 50.16,23.44 SV4.6
  Bottom 0.152: SV4.6 48.8,22.05 48.8,7.07 J1.C14
B64_L5_P
  Top 0.152: U$2.Y14 40.78,35.23 40.78,34.52 41.09,34.2 41.52,34.2 41.76,33.96 41.76,33.16 46.14,28.78 46.14,21.93 SV4.1
  Bottom 0.152: SV4.1 45.08,16.92 46.33,15.67 46.33,7.08 J1.C15
B64_L6_P  (via drill 0.35)
  Top 0.152: U$2.AA16 42.76,34.2 42.76,33.48 42.65,33.38 42.65,32.73 46.45,28.94 46.45,22.05 SV4.3 | v47.56,15.99 47.86,15.69 47.86,8.68 v47.56,8.38
  Bottom 0.152: SV4.3 47.57,20.82 v47.57,15.99 v47.56,15.99 | v47.56,8.38 48.2,7.75 J1.D14
B64_L15_N  (via drill 0.35)
  Top 0.152: U$2.M19 46.79,43.21 48.51,43.21 48.79,42.93 48.79,42.49 49.06,42.22 49.49,42.22 49.72,41.99 50.69,41.99 v50.93,41.75 53.82,44.64 58.83,44.64 60.28,43.19 60.28,42.01 61.28,41.01 SV2.4
  Bottom 0.152: v50.93,41.75 46.41,41.75 40.34,35.68 40.34,20.62 43.73,17.23 43.73,13.83 43.3,13.4 42.88,13.4 42.3,12.82 J1.H19
B64_L15_P  (via drill 0.3, 0.35)
  Top 0.152: U$2.M4 30.95,43.73 30.45,44.23 30.12,44.23 30.1,44.25 30.08,44.25 29.8,44.53 29.8,44.55 29.75,44.6 29.75,44.92 29.47,45.2 29.15,45.2 29.13,45.22 29.1,45.25 29.08,45.25 28.8,45.53 28.8,45.55 28.77,45.58 28.77,45.91 28.46,46.22 28.05,46.22 27.47,46.8 26.8,46.8 v25.84,45.84 25.83,45.84 25.56,45.57 23.67,45.57 18.44,50.8 18.44,53.58 15.64,56.38 15.64,57.81 14.63,58.82 SV3.2 | v22.93,25.52 25.38,23.07 34.09,23.07 40.57,16.59 40.57,14.15 v39.92,13.5
  Bottom 0.152: v25.84,45.84 25.84,45.82 23.45,43.43 23.45,42.05 17.64,36.24 17.64,22.54 17.25,22.15 17.25,20.59 17.97,19.87 18.45,19.87 22.93,24.36 v22.93,25.52 | v39.92,13.5 40.59,12.83 J1.H20
B64_L19_N  (via drill 0.35)
  Top 0.152: U$2.M22 49.27,43.45 v50.13,42.6 51.3,42.6 53.65,44.95 58.99,44.95 61.28,42.66 SV2.6
  Bottom 0.152: v50.13,42.6 46.82,42.6 40.02,35.8 40.02,18.02 42.5,15.55 42.5,13.83 42.09,13.42 41.6,13.42 41.2,13.03 41.2,12.21 J1.G19
B64_L19_P  (via drill 0.35)
  Top 0.152: U$2.N3 29.77,42.22 29.27,42.22 29.24,42.25 29.08,42.25 28.8,42.53 28.8,42.91 28.47,43.24 27.48,43.24 27.37,43.13 v26.25,43.13 v26.24,43.12 24.35,43.12 17.21,50.26 17.21,52.97 15.6,54.58 SV3.6 | v19.18,22.32 20.62,20.88 32.09,20.88 38,14.97 38,12.84 38.67,12.17 v38.67,10.89 v38.68,10.89
  Bottom 0.152: v19.18,22.32 18.88,22.62 18.88,35.71 18.89,35.71 24.7,41.52 24.7,42.61 25.21,43.12 v26.24,43.12 | v38.68,10.89 42.46,10.89 J1.G18
B65_L1_N  (via drill 0.35)
  Top 0.152: U$2.A5 32.08,54.92 32.08,55.24 31.93,55.39 v31.93,56.24 31.93,56.69 36.22,60.98 36.22,66.58 34.71,68.09 34.71,69.12 34.01,69.82 31.97,69.82 SV1.13
  Bottom 0.152: v31.93,56.24 31.93,51.36 29.02,48.45 29.02,28.71 18.35,18.04 18.35,12.2 J1.G37
B65_L6_N  (via drill 0.35)
  Top 0.152: U$2.L1 28.27,44.72 28.14,44.72 27.39,45.47 v26.64,45.47 v26.64,45.46 26.28,45.46 26.08,45.26 23.54,45.26 18.12,50.68 18.12,53.47 14.63,56.96 SV3.4 | v18.21,20.49 18.76,19.94 26.95,19.94 30.41,16.48 30.41,16 29.54,15.13 29.54,8.64 v31.1,7.08
  Bottom 0.152: v26.64,45.46 26.37,45.19 25.67,45.19 23.77,43.29 23.77,41.94 17.95,36.12 17.95,22.42 17.55,22.03 17.55,21.14 v18.21,20.49 | J1.D27 31.7,7.68 v31.1,7.08
B65_L6_P  (via drill 0.3, 0.35)
  Top 0.152: U$2.L19 46.77,45.23 48.48,45.23 48.8,45.54 48.8,45.92 49.08,46.2 49.49,46.2 49.84,45.85 50.7,45.85 v50.84,45.71 51.03,45.9 60.36,45.9 SV2.8 | v32.18,16.58 32.07,16.47 32.07,8.62 v32.32,8.37
  Bottom 0.152: v50.84,45.71 48.62,45.71 39.08,36.17 39.08,25.1 32.2,18.22 32.2,16.6 v32.18,16.58 | v32.32,8.37 32.34,8.37 J1.D26
B65_L9_N  (via drill 0.35)
  Top 0.152: U$2.M1 v27.13,43.73 v27.12,43.73 24.18,43.73 17.51,50.4 17.51,53.16 15.09,55.58 13.63,55.58 SV3.3 | v19.08,21.38 19.9,20.56 30.67,20.56 34.59,16.64 34.59,15.8 38.01,12.39 38.01,11.55 v37.41,10.95
  Bottom 0.152: v27.12,43.73 27,43.85 25.26,43.85 24.39,42.98 24.39,41.64 18.76,36.02 18.75,36.02 18.59,35.85 18.57,35.85 18.57,21.89 v19.08,21.38 | v37.41,10.95 38.02,11.55 J1.G22
B65_L9_P  (via drill 0.35)
  Top 0.152: U$2.M3 29.95,43.73 29.48,43.24 29.02,43.24 28.8,43.48 28.8,43.91 28.5,44.21 28.11,44.21 27.6,44.72 26.84,44.72 v26.63,44.51 26.61,44.49 23.87,44.49 17.82,50.55 17.82,53.3 15.22,55.89 13.81,55.89 13.11,56.59 13.11,57.53 12.09,58.55 SV3.1 | v18.16,21.43 19.34,20.25 30.55,20.25 34.29,16.51 34.29,15.68 37.39,12.58 v37.39,12.15 v37.4,12.14
  Bottom 0.152: v26.63,44.51 25.43,44.51 24.08,43.16 24.08,41.81 18.26,35.99 18.26,21.53 v18.16,21.43 | v37.4,12.14 38.73,12.14 J1.G21
B65_L10_N  (via drill 0.3, 0.35)
  Top 0.152: U$2.L20 47.77,44.23 49.47,44.23 50.29,43.41 v50.94,43.41 51.67,43.41 53.52,45.26 59.13,45.26 60.72,43.67 61.68,43.67 62.48,42.87 62.48,39.8 63.82,38.46 SV2.1 | v33.37,16.49 33.37,6.87 v32.35,5.85 v32.35,5.84
  Bottom 0.152: v50.94,43.41 v50.93,43.42 47.21,43.42 39.71,35.92 39.71,24.82 33.37,18.48 v33.37,16.49 | v32.35,5.84 32.33,5.84 J1.C27
B65_L10_P  (via drill 0.3, 0.35)
  Top 0.152: U$2.L22 50.09,44.73 v50.41,44.41 50.79,44.03 51.85,44.03 53.41,45.59 59.26,45.59 60.87,43.98 61.8,43.98 62.8,42.98 62.8,41.95 63.82,40.93 SV2.3 | v32.78,17.19 32.78,16.32 32.39,15.93 32.39,9.26 32.97,8.68 32.97,7.79 v32.35,7.17 v32.35,7.16
  Bottom 0.152: v50.41,44.41 v50.4,44.42 47.78,44.42 39.41,36.05 39.41,24.96 32.78,18.34 v32.78,17.19 | v32.35,7.16 32.97,6.54 J1.C26
B65_L16_N  (via drill 0.35)
  Top 0.152: U$2.D11 37.77,52.23 37.77,52.91 38.06,53.2 38.07,53.2 38.08,53.2 38.45,53.2 38.76,53.51 38.76,53.89 39.07,54.21 39.46,54.21 39.78,54.53 39.78,55.01 40,55.23 v40,56.16 40,56.6 39.36,57.24 39.36,64.45 43.3,68.39 43.36,68.39 SV1.4
  Bottom 0.152: v40,56.16 40,55.01 32.07,47.08 32.07,27.34 24.41,19.68 24.41,17.07 23.38,16.04 23.38,12.6 22.8,12.03 J1.G34
B65_L16_P  (via drill 0.35)
  Top 0.152: U$2.E22 49.97,51.42 v50.21,51.42 51.12,51.42 54.45,48.09 59.09,48.09 60.29,49.3 60.29,50.49 60.86,51.06 62.28,51.06 SV2.13
  Bottom 0.152: v50.21,51.42 50.19,51.42 49.25,50.48 49.25,49.45 36.9,37.09 36.9,30.86 26.45,20.41 26.45,16.01 25.95,15.51 25.95,12.6 25.55,12.21 24.73,12.21 J1.G33
B65_L23_N  (via drill 0.3, 0.35)
  Top 0.152: U$2.H22 49.45,47.55 49.66,47.55 50.01,47.21 v50.75,47.21 51.17,47.21 51.85,46.53 61.68,46.53 63.23,44.98 SV2.7 | v31,16.51 31,16.41 31.43,15.98 31.43,10 31.02,9.59 v31,9.59
  Bottom 0.152: v50.75,47.21 50.72,47.24 49.25,47.24 38.46,36.45 38.46,25.37 31,17.91 v31,16.51 | v31,9.59 J1.E28
B65_L23_P  (via drill 0.3, 0.35)
  Top 0.152: U$2.J21 48.77,47.22 49.53,47.22 50.11,46.64 v50.11,46.47 51.46,46.47 51.71,46.22 61.53,46.22 62.32,45.43 62.32,43.94 SV2.5 | v31.58,17.52 31.58,16.26 31.76,16.08 31.76,9.04 31.07,8.35 v31.05,8.37
  Bottom 0.152: v50.11,46.47 48.92,46.47 38.78,36.33 38.78,25.24 31.58,18.05 v31.58,17.52 | v31.05,8.37 31.7,9.01 J1.E27
B66_L10_N  (via drill 0.35)
  Top 0.152: U$2.U1 27.79,38.73 27.32,39.19 26.84,39.19 v26.79,39.14 26.14,39.14 15.63,49.66 15.63,49.95 15.03,50.55 14.16,50.55 13.09,49.48 13.09,47.96 SV3.11 | v22.14,24.59 24.27,22.46 32.7,22.46 39.92,15.24 v39.92,14.69 v39.91,14.69
  Bottom 0.152: v26.79,39.14 26.31,38.66 24.07,38.66 20.43,35.02 20.43,25.7 21.06,25.07 21.66,25.07 v22.14,24.59 | v39.91,14.69 J1.J21
B66_L10_P  (via drill 0.35)
  Top 0.152: U$2.U2 28.98,38.73 28.48,38.23 27.39,38.23 v27.29,38.33 26.53,38.33 26.52,38.33 15.35,49.5 SV3.10 | v21.61,25.76 21.84,25.76 24.82,22.77 32.84,22.77 37.02,18.58 v37.47,18.58
  Bottom 0.152: v27.29,38.33 24.19,38.33 20.74,34.88 20.74,27.5 21.61,26.62 v21.61,25.76 | v37.47,18.58 v37.48,18.57 37.48,14.66 J1.J22
B66_L15_N  (via drill 0.35)
  Top 0.152: U$2.R3 29.98,40.73 29.49,40.23 28.06,40.23 27.77,40.52 26.96,40.52 v26.86,40.62 26.7,40.46 25.7,40.46 16.25,49.91 16.25,50.23 14.63,51.86 SV3.8 | v21.1,23.55 22.82,21.83 32.44,21.83 38.91,15.35 38.91,13.21 42.51,9.62 v42.51,8.36 v42.5,8.36
  Bottom 0.152: v26.86,40.62 26.38,40.14 24.66,40.14 19.81,35.29 19.81,25.43 20.62,24.62 20.62,24.03 v21.1,23.55 | J1.E19 41.85,9.01 v42.5,8.36
B66_L15_P  (via drill 0.35)
  Top 0.152: U$2.T3 29.76,39.21 28.07,39.21 v27.45,39.83 v27.44,39.84 25.89,39.84 15.94,49.79 15.94,50.07 15.16,50.85 14.88,50.85 14.86,50.87 14.03,50.87 12.66,49.5 SV3.9 | v21.23,24.46 23.54,22.15 32.57,22.15 39.22,15.5 39.22,13.34 43.76,8.8 v43.76,8.37
  Bottom 0.152: v27.45,39.83 24.79,39.83 20.12,35.16 20.12,25.57 v21.23,24.46 | J1.E18 v43.76,8.38 v43.76,8.37
B66_L24_N  (via drill 0.3, 0.35)
  Top 0.152: v20.19,23.43 22.1,21.52 32.32,21.52 38.61,15.23 38.61,13.09 41.21,10.49 v41.21,9.62 v41.22,9.62 | U$2.P1 27,41.73 26.34,41.06 v26.09,41.06 25.54,41.06 16.58,50.02 16.58,51.54 15.05,53.07 13.12,53.07 SV3.7
  Bottom 0.152: v41.22,9.62 41.85,10.26 J1.F19 | v26.09,41.06 25.49,40.46 24.53,40.46 19.5,35.44 19.5,25.31 20.19,24.62 v20.19,23.43
B66_L24_P  (via drill 0.3, 0.35)
  Top 0.152: v20.07,22.52 21.39,21.2 32.2,21.2 38.31,15.1 38.31,12.96 39.96,11.31 v39.96,9.63 v39.95,9.63 | U$2.P2 29.09,41.73 28.54,42.27 28.5,42.27 28.43,42.21 26.74,42.21 26.43,41.9 v26.33,41.9 25.14,41.9 16.89,50.15 16.89,51.66 15.18,53.38 13.29,53.38 SV3.5
  Bottom 0.152: v39.95,9.63 39.95,9.65 J1.F20 | v26.33,41.9 25.52,41.9 19.18,35.57 19.18,23.27 19.93,22.52 v20.07,22.52
B228_TX3_N  (via drill 0.3, 0.35)
  Top 0.152: U$2.F21 48.78,50.23 49.37,50.23 49.39,50.25 49.47,50.25 49.75,50.53 49.75,50.61 49.94,50.8 v50.88,50.8 51.27,50.8 54.3,47.77 59.21,47.77 61.28,49.84 SV2.12 | v28.02,16.84 28.02,15.94 28.29,15.68 28.29,5.57 v27.29,4.57
  Bottom 0.152: v50.88,50.8 50.02,50.8 49.57,50.35 49.57,49.32 37.21,36.97 37.21,25.96 28.98,17.73 28.82,17.73 28.3,17.21 28.3,17.05 28.09,16.84 v28.02,16.84 | v27.29,4.57 26.66,3.94 J1.A31
B228_TX3_P  (via drill 0.3, 0.35)
  Top 0.152: U$2.F22 49.81,49.73 v50.24,50.16 51.48,50.16 54.17,47.47 59.37,47.47 60.78,48.88 62.64,48.88 SV2.11 | v28.61,16.21 28.61,4.65 v28.53,4.57
  Bottom 0.152: v50.24,50.16 49.89,49.8 49.89,49.21 37.52,36.83 37.52,25.84 29.11,17.43 28.95,17.43 28.61,17.09 v28.61,16.21 | v28.53,4.57 J1.A30
B229_RX2_N  (via drill 0.35)
  Top 0.152: U$2.V2 28.78,37.23 v26.87,37.23 v26.86,37.22 26.86,37.56 18.93,45.49 13.21,45.49 12.14,44.42 SV3.13 | v23.84,25.71 26.17,23.38 34.22,23.38 45.04,12.56 v45.04,5.86 v45.05,5.86
  Bottom 0.152: v26.86,37.22 26.31,36.67 22.98,36.67 21.05,34.74 21.05,27.64 22.18,26.51 23.04,26.51 v23.84,25.71 | v45.05,5.86 J1.B17
B229_RX2_P  (via drill 0.35)
  Top 0.152: U$2.V3 30.27,37.41 29.79,36.93 29.79,36.49 29.52,36.22 27.51,36.22 v27.39,36.34 26.8,36.34 26.25,36.89 26.25,37.73 18.8,45.18 15.39,45.18 SV3.14 | v24.24,26.53 27.08,23.69 34.36,23.69 45.35,12.7 45.35,6.8 v46.32,5.83
  Bottom 0.152: v27.39,36.34 23.1,36.34 21.36,34.6 21.36,28.92 21.36,28.91 21.36,27.76 22.31,26.82 23.95,26.82 v24.24,26.53 | v46.32,5.83 45.7,5.21 J1.B16
B229_RX3_N  (via drill 0.35)
  Top 0.152: U$2.AA17 43.77,34.22 43.77,33.53 43.9,33.4 43.9,32.92 48.5,28.32 48.5,24.29 SV4.4 48.78,22.25 48.78,20.3 48.48,20 48.48,6.18 v48.8,5.86
  Bottom 0.152: v48.8,5.86 48.82,5.86 J1.B13
B229_RX3_P
  Top 0.152: U$2.AA18 45.27,34.52 45.8,34.01 45.8,31.91 49.13,28.57 49.13,23.01 50.2,21.95 51.62,21.95 SV4.7
  Bottom 0.152: J1.B12 51.34,5.8 53.45,5.8 53.89,6.24 53.89,19.68 SV4.7
B229_TX0_N  (via drill 0.35)
  Top 0.152: U$2.B4 30.77,54.23 30.77,55.21 30.39,55.59 v30.37,55.59 30.37,56.05 35.57,61.25 35.57,66.32 33.35,68.54 SV1.12 | v20.81,3.01 20.81,3.73 19.34,5.21 19.34,8.19 16.55,10.98 16.55,16.7 v16.49,16.76
  Bottom 0.152: v30.37,55.59 30.37,50.7 28.41,48.74 28.41,28.96 16.61,17.16 16.61,16.88 v16.49,16.76 | J1.A35 21.54,3.73 v20.81,3.01
B229_TX0_P  (via drill 0.35)
  Top 0.152: U$2.B5 32.27,54.03 31.77,54.54 31.77,55.12 v31.28,55.61 31.28,56.49 35.91,61.12 35.91,66.45 34.4,67.96 34.4,68.99 33.89,69.5 29.75,69.5 SV1.15 | v17.42,16.79 16.87,16.24 16.87,11.1 19.64,8.33 19.64,5.35 21.37,3.62 21.51,3.62 v22.11,3.02
  Bottom 0.152: v31.28,55.61 31.28,51.16 28.72,48.6 28.72,28.84 17.42,17.54 v17.42,16.79 | J1.A34 22.11,3.24 v22.11,3.02
B229_TX2_N  (via drill 0.35)
  Top 0.152: U$2.A11 38.47,54.91 38.47,56.27 v38.49,56.29 39.04,56.84 39.04,64.57 42.35,67.88 42.35,68.99 42.94,69.58 44.55,69.58 SV1.1 | v23.77,17.54 23.77,12.12 24.43,11.46 24.43,9.77 21.76,7.1 v20.88,7.1
  Bottom 0.152: v38.49,56.29 38.38,56.18 38.38,53.83 31.77,47.22 31.77,27.5 23.82,19.55 23.82,17.54 v23.77,17.54 | v20.88,7.1 20.88,7.04 19.9,7.04 19.64,6.78 19.64,5.85 J1.B37
B229_TX3_N  (via drill 0.35)
  Top 0.152: U$2.B6 32.76,54.24 32.76,55.42 v32.65,55.52 32.71,55.58 32.71,57.02 36.54,60.85 36.54,67 36.54,67.16 36.54,67.79 SV1.10 | v18.98,17.52 18.98,17.42 17.2,15.64 17.2,11.22 19.95,8.47 19.95,5.49 21.48,3.96 22.48,3.96 v23.43,3.01
  Bottom 0.152: v32.65,55.52 32.65,51.63 29.33,48.31 29.33,28.57 18.98,18.23 v18.98,17.52 | J1.B33 23.41,4.54 23.41,3.02 v23.43,3.01
B229_TX3_P  (via drill 0.35)
  Top 0.152: U$2.B7 34.79,54.24 34.79,54.98 34.57,55.2 v34.57,56.19 v34.58,56.2 34.58,57.55 37.47,60.44 37.47,65.28 38.5,66.31 38.5,68.37 SV1.8 | v20.61,17.52 20.85,17.28 20.85,11.9 22.79,9.96 22.79,9.41 21.12,7.74 20.66,7.74 20.27,7.35 20.27,5.61 21.61,4.27 23.07,4.27 24.33,3.01 v24.65,3.01
  Bottom 0.152: v34.58,56.2 34.58,55.22 34.57,55.21 34.57,52.23 30.24,47.91 30.24,28.17 20.3,18.23 20.3,17.82 v20.61,17.52 | J1.B32 25.34,5.18 24.69,4.53 24.69,3.01 v24.65,3.01
B230_TX0_N  (via drill 0.3, 0.35)
  Top 0.152: U$2.G21 48.77,49.22 50.62,49.22 v50.86,49.46 51.74,49.46 54.04,47.16 59.51,47.16 60.87,48.52 61.73,48.52 62.73,47.52 SV2.9 | v29.19,16.84 29.19,15.95 28.93,15.69 28.93,5.42 v29.75,4.6
  Bottom 0.152: v50.86,49.46 50.59,49.46 37.82,36.69 37.82,25.65 29.19,17.02 v29.19,16.84 | v29.75,4.6 29.16,5.2 J1.B29
B230_TX0_P  (via drill 0.3, 0.35)
  Top 0.152: U$2.H20 47.78,48.23 49.88,48.23 v50.09,48.02 50.81,48.02 51.98,46.85 60.61,46.85 SV2.10 | v29.81,16.25 29.81,16.12 29.24,15.55 29.24,6.39 v29.82,5.81
  Bottom 0.152: v50.09,48.02 49.59,48.02 38.14,36.57 38.14,25.52 29.77,17.16 29.77,16.29 v29.81,16.25 | v29.82,5.81 J1.B28
GND  (via drill 0.3, 0.35)
  Top 0.152: U$2.R8 U$2.P9 | U$2.P9 U$2.N9 U$2.M9 U$2.L9 U$2.K9 U$2.J9 | U$2.J9 U$2.H8 | U$2.J9 U$2.J10 U$2.J11 U$2.J12 U$2.J13 U$2.J14 | U$2.J14 U$2.K14 U$2.L14 U$2.M14 U$2.N14 U$2.P14 | U$2.J14 U$2.H15 | U$2.P14 U$2.R15 | U$2.P14 U$2.P13 U$2.P12 U$2.P11 U$2.P10 U$2.P9 | U$2.D14 U$2.C14 U$2.B14 | U$2.B14 U$2.A15 | U$2.B14 U$2.B13 U$2.C13 | U$2.D17 U$2.D18 45.52,51.73 46,52.2 | 46,52.2 46.47,52.2 46.75,51.92 46.75,50.53 46.27,50.05 U$2.F19 U$2.G19 46.27,48.4 45.8,47.92 45.8,46.53 46.27,46.05 U$2.K19 | U$2.L4 U$2.K4 U$2.J4 30.95,46.73 30.47,46.25 29.08,46.25 28.75,46.57 28.75,46.92 28.47,47.2 27.39,47.2 v27.21,47.38 | U$2.U19 U$2.T19 | U$2.V19 45.95,37.73 45.47,37.25 44.8,37.25 U$2.W17 U$2.W16 43.03,36.73 42.55,37.2 42.08,37.2 41.75,36.88 41.75,36.53 41.47,36.25 41.08,36.25 40.6,36.73 U$2.W13 U$2.Y13 U$2.AA13 U$2.AB13 39.95,33.73 39.47,33.25 38.08,33.25 37.6,33.73 U$2.AB10 | U$2.AB10 U$2.AA10 U$2.Y10 U$2.W10 | U$2.W6 U$2.W7 34.27,36.4 34.75,35.92 34.75,34.53 34.27,34.05 U$2.AB7 34.27,33.12 v34.06,32.9 | U$2.Y3 U$2.Y2 29.27,35.4 28.8,34.92 28.8,34.25 U$2.AB1 27.57,33.73 v27.42,33.57 | U$2.Y3 U$2.AA3 | U$2.Y3 30.8,36.25 30.8,36.92 31.27,37.4 U$2.V4 U$2.U4 30.75,38.2 30.08,38.2 29.8,37.92 29.8,37.37 29.48,37.06 29.48,36.94 U$2.W2 U$2.W1 | U$2.T1 U$2.T2 29.48,39.92 29.62,39.92 29.94,40.25 30.47,40.25 30.75,40.53 30.75,40.92 30.47,41.2 | 30.47,41.2 30.03,41.2 29.55,40.73 U$2.R2 28.95,40.73 28.47,41.2 27.67,41.2 v27.59,41.12 | 30.47,41.2 30.8,41.53 30.8,41.92 31.27,42.4 U$2.N4 | U$2.G4 U$2.F4 U$2.E4 U$2.D3 29.95,51.73 29.47,51.25 29.08,51.25 28.6,51.73 U$2.D1 28.27,51.4 27.8,50.92 27.8,50.43 v27.59,50.22 27.59,49.41 U$2.G1
  Top 0.152: U$2.D6 33.03,51.73 32.55,52.2 31.05,52.2 30.53,52.73 U$2.C3 U$2.C2 28.76,53.24 v27.61,53.24 | U$2.D10 U$2.D9 36.8,52.25 36.8,52.95 37.27,53.43 U$2.B10 37.06,53.94 37.06,54.05 36.6,54.51 36.49,54.51 U$2.A9 36.53,54.98 v36.53,55.61 | U$2.B11 38.45,53.91 38.45,54.02 38.95,54.51 39.06,54.51 U$2.A12 39.09,54.91 v39.09,55.54 | U$2.A4 31.27,54.4 31.75,53.92 31.75,53.53 31.47,53.25 31.08,53.25 30.6,53.73 U$2.B3 30.03,53.73 29.55,54.2 29.12,54.2 28.59,54.73 U$2.A1 28.27,56.08 v28.36,56.16 | U$2.C20 U$2.C21 U$2.D21 U$2.D22 49.71,52.16 v50.88,52.16 | U$2.N22 49.09,42.91 49.09,43.06 48.64,43.52 48.48,43.52 U$2.M21 U$2.M20 46.95,43.73 46.47,44.2 46.08,44.2 45.8,43.92 45.8,43.53 46.27,43.05 U$2.N19 46.27,42.4 45.8,41.92 45.8,40.53 46.27,40.05 U$2.T19 | U$2.L21 48.47,44.92 48.61,44.92 49.1,45.41 49.1,45.55 U$2.K22 49.53,45.73 50.16,45.1 51,45.1 v51.26,44.84 | U$2.AA20 U$2.Y20 47.6,35.73 48.08,36.2 48.46,36.2 48.98,36.73 U$2.W22 50,36.73 50,36.74 v50.44,37.18 | U$2.N1 26.86,42.73 26.62,42.49 25.49,42.49 v25.45,42.53 | U$2.A22 48.65,55.35 v48.65,55.65 | v46.29,55.61 46.27,55.59 U$2.A19 45.8,54.25 45.8,52.53 46,52.32 46,52.2 | U$2.G22 50.97,48.73 v51.14,48.55 | v50.09,39.72 v50.09,39.73 U$2.T22 48.95,39.73 48.47,39.25 47.08,39.25 46.6,39.73 U$2.T19 | U$2.AB22 49.27,33.3 v48.83,32.85 | U$2.AB19 46.3,33.7 46.3,33.04 v46.42,32.91 | U$2.AB16 43.27,32.98 v43.29,32.97 | U$2.AB10 36.49,32.94 v35.98,32.94 | U$2.M2 U$2.L2 29.05,44.73 28.27,45.49 U$2.K1 27.62,45.73 v27.15,46.2
  Bottom 0.152: v25.45,42.53 25.49,42.49 26.74,42.49 27.73,43.48 27.73,50.08 v27.59,50.22 | J1.F39 J1.G38 J1.H39 J1.J38 J1.K39 J1.J40 | J1.E40 J1.D39 J1.E38 J1.D37 19.72,8.47 19.72,8.79 | J1.C40 16.33,5.33 | 16.33,5.33 J1.B39 J1.B38 | J1.A40 16.33,5.08 16.33,5.33 | J1.B38 J1.C38 | J1.B38 J1.A37 19.72,4.66 19.72,5.43 20.27,5.98 J1.C36 | J1.B34 J1.B35 J1.A36 | 25.41,6.41 J1.C32 J1.C33 J1.C34 J1.D35 | 25.41,6.41 J1.B31 | J1.B31 J1.A32 | J1.A1 J1.B2 | J1.B2 J1.B3 J1.A4 | J1.B2 J1.C1 J1.D2 | J1.D2 J1.D3 | J1.D3 J1.C4 J1.C5 | J1.C5 J1.D6 | J1.D6 J1.E5 | J1.E5 J1.E4 60.96,8.96 | 60.96,8.96 J1.D3 | J1.D2 J1.E1 J1.F2 | J1.C5 J1.B6 | J1.B6 J1.A5 | J1.B6 J1.B7 | J1.B7 J1.A8 | J1.D6 J1.D7 56.92,7.92 | 56.92,7.92 J1.E8 J1.F9 55.63,11.37 | 55.63,11.37 J1.G8 J1.H9 | J1.C12 J1.C13 J1.D13 50.2,8.47 50.2,9.24 50.74,9.79 J1.F12 | J1.F12 J1.E11 J1.D10 | J1.F12 J1.G11 J1.H12 J1.J11 J1.K12 | J1.K9 J1.J8 J1.H9 | J1.H9 55.63,11.74 55.63,11.37 | J1.E14 J1.F15 J1.G14 J1.H15 J1.J14 J1.K15 | J1.A16 J1.B15 47.3,5.21 47.31,5.19 47.81,5.19 47.83,5.21 J1.B14 J1.A13 | J1.A17 J1.B18 | J1.B18 J1.C17 J1.C16 J1.D16 J1.E17 J1.F18 J1.G17 J1.H18 43.58,12.82 44.4,13.64 J1.J17 | J1.B18 J1.B19 | J1.B19 J1.A20 | J1.B19 J1.C20 | J1.C20 J1.D19 J1.E20 40.09,9.02 39.54,8.47 39.09,8.47 38.77,8.79 38.77,9.24 39.31,9.79 J1.F21 | J1.C20 J1.C21 | J1.C21 J1.B22 | J1.B22 J1.A21 | J1.B22 J1.B23 | J1.B23 J1.A24 | J1.B23 J1.C24 J1.C25 | J1.C21 J1.D22 J1.E23 J1.F24 J1.G23 J1.H24 J1.J23 J1.K24 | J1.K27 J1.J26 J1.H27 J1.G26 J1.F27 J1.E26 J1.D25 J1.C25 | J1.C25 J1.B26 J1.B27 | J1.B27 J1.C28 | J1.C28 J1.D28 J1.E29 J1.F30 J1.G29 J1.H30 J1.J29 J1.K30 | J1.C28 J1.C29 J1.B30 J1.B31 | J1.A28 J1.B27 | 19.72,8.79 20.04,8.47 20.49,8.47 21.04,9.02 J1.E35
  Bottom 0.152: 19.72,8.79 19.72,9.29 20.27,9.84 J1.F36 20.59,10.61 21.21,11.23 J1.G35 J1.H36 J1.J35 J1.K36 | J1.G32 J1.F33 J1.E32 25.89,8.47 25.89,7.52 25.41,7.03 25.41,6.41 | J1.G20 J1.H21 39.31,13.24 38.77,13.79 38.77,14.4 39.31,14.95 J1.K21 | J1.A12 J1.B11 J1.B10 | J1.B10 J1.A9 | J1.B10 J1.C9 J1.C8 | J1.C8 56.92,7.57 56.92,7.92 | J1.C8 J1.B7 | J1.E5 J1.F6 J1.G5 | J1.G5 J1.H6 J1.J5 | J1.G5 J1.G4 | J1.G4 J1.H3 J1.J4 | J1.G4 J1.F3 | J1.F3 62.17,10.18 60.96,8.96 | J1.F3 J1.F2 | J1.F2 J1.G1 | J1.J4 J1.K3 | J1.K2 J1.J1 | J1.J4 J1.J5 | J1.J5 J1.K6 | J1.K18 v43.12,16.36 | J1.H33 J1.J32 J1.K33 24.74,16.03 v24.74,16.37
  other vias: 36.76,46.2 38.77,46.22 40.77,46.23 39.77,45.22 36.76,44.25 37.77,45.24 38.76,44.23 40.76,44.25 39.77,43.24 38.79,42.21 37.77,43.24 36.78,42.23 40.77,42.24
  pour Bottom: 5,0 5,38 4,39 1,39 0,40 0,96 74,96 74,0
  pour Top (isolate 0.254): 5,0 5,38 4,39 1,39 0,40 0,96 74,96 74,0
VADJ  (via drill 0.45)
  Top 0.406: JP1.1 72,56.01 72,18 55.68,1.68 17.16,1.68 14,4.84 v14,9
  Bottom 0.406: v14,9 14,9.1 J1.F40 | J1.E39 J1.F40 | J1.F40 J1.G39 J1.H40
VDD_CORE  (via drill 0.4, 0.45)
  Top 0.152: U$2.J15 U$2.K15 U$2.L15 U$2.M15 U$2.N15 U$2.P15 42.75,41.25 42.75,38.53 42.75,38.52 42.75,38.21 | U$2.P8 U$2.N8 U$2.M8 U$2.L8 U$2.K8 U$2.J8 35.27,47.05 34.8,47.53 34.8,51.2 U$2.D7 | U$2.D7 33.95,51.73 33.43,51.2 33.12,51.2 32.6,51.73 U$2.D5 U$2.D4 30.95,51.73 30.47,52.2 27.52,52.2 26.08,53.64 26.08,56.56 27.15,57.63 27.15,62.02 v27.01,62.16 | U$2.D7 U$2.D8 | U$2.D8 U$2.C8 | U$2.D8 35.76,51.24 35.76,48.24 U$2.H9 U$2.H10 U$2.H11 U$2.H12 U$2.H13 U$2.H14 41.8,48.25 41.8,50.92 42.27,51.4 U$2.D15 U$2.D16 43.6,51.73 44.08,51.25 45.47,51.25 45.95,51.73 U$2.D19 U$2.E19 | U$2.W15 42.6,36.73 43.08,36.25 44.47,36.25 44.95,36.73 U$2.W18 U$2.W19 46.8,37.25 48.08,37.25 | U$2.W4 U$2.W5 32.6,36.73 33.08,37.2 34.47,37.2 34.95,36.73 U$2.W8 35.8,37.25 35.8,39.92 36.27,40.4 U$2.R9 U$2.R10 U$2.R11 U$2.R12 U$2.R13 U$2.R14 41.79,40.21 41.79,38.53 42.11,38.21 42.75,38.21 | 48.08,37.25 47.8,37.53 47.8,37.88 47.47,38.21 42.75,38.21 | v55.22,38.22 54.85,37.85 50.12,37.85 49.52,37.25 48.08,37.25
  Top 0.406: VDD_CORE.1 17.74,74.75 C1.1 11.38,72.54 C5.1
  Top 0.61: VDD.P$1 9.61,76.52 C1.1 23.99,62.14 26.99,62.14 v27.01,62.16
  Bottom 0.406: v27.01,62.16 27.03,62.14 44.86,62.14 56,51 56,39 v55.22,38.22
VDD_IO  (via drill 0.3, 0.4)
  Top 0.152: U$2.F3 U$2.G3 | U$2.G3 U$2.H4 31.75,47.25 31.75,43.92 | U$2.B12 39.27,53.4 38.6,52.73 | U$2.B9 35.75,53.2 35.08,53.2 34.8,52.92 34.8,52.57 34.47,52.25 34.08,52.25 33.6,52.73 U$2.C6 32.95,52.73 32.47,53.2 32.08,53.2 31.6,52.73 U$2.C4 30.96,52.73 30.44,53.25 30.08,53.25 29.6,53.73 U$2.B2 29.1,53.9 28.99,53.9 28.64,54.25 28.08,54.25 27.78,54.54 27.78,57.78 v27.96,57.96 | U$2.C11 38.6,52.73 | 38.6,52.73 39.12,52.2 40.47,52.2 40.8,51.88 40.8,51.53 41.08,51.25 41.47,51.25 41.77,51.54 41.77,53.22 U$2.B15 | U$2.B15 42.6,53.73 43.08,53.25 43.75,53.25 U$2.C17 | U$2.B20 47.27,53.4 46.8,52.92 46.8,52.53 47.27,52.05 U$2.D20 U$2.E20 U$2.F20 U$2.G20 U$2.H19 46.8,47.2 47.47,47.2 47.75,46.92 47.75,46.25 U$2.K21 | U$2.B20 U$2.B21 | U$2.U20 U$2.U21 U$2.V21 U$2.V22 49.34,37.73 50.07,38.45 v52.24,38.45 | U$2.R19 U$2.R20 47.8,41.25 | U$2.N21 48.27,42.4 47.8,41.92 47.8,41.25 | U$2.AA2 29.8,34.2 31.8,34.2 U$2.AB5 | U$2.AB5 32.8,34.25 32.8,34.92 33.27,35.4 U$2.Y6 | U$2.V1 28.48,37.92 28.61,37.92 28.93,38.25 29.47,38.25 29.95,38.73 U$2.U3 U$2.T4 U$2.R4 31.27,41.05 31.75,41.53 31.75,42.92 | U$2.B15 42.27,54.05 42.75,54.53 42.75,54.95 v46.19,58.39 | v26.81,48.38 26.97,48.22 29.77,48.22 U$2.G3 | U$2.AA21 48.27,35.03 48.78,35.55 48.78,35.97 49.03,36.21 54.68,36.21 56.71,38.24 56.1,38.85 54.96,38.85 54.55,38.45 v52.24,38.45 | U$2.AA14 41.8,35.25 42.47,35.25 42.95,35.73 U$2.Y16 U$2.Y17 44.27,35.4 44.75,34.92 44.75,34.25 U$2.AB18 45.27,33.17 v45.12,33.02 | 34.75,31.3 35.27,30.78 v40.96,30.78 | U$2.N2 29.38,42.72 29.91,43.25 31.43,43.25 31.75,42.92 | 31.75,42.92 31.75,43.92
  Top 0.152: v52.24,38.45 49.44,41.25 47.8,41.25 | U$2.AA9 35.75,34.2 35.08,34.2 35.05,34.18 35.03,34.18 34.75,33.9 34.75,31.3 | U$2.AB5 34.7,31.3 34.75,31.3 | U$2.K2 29.6,45.73 30.12,45.2 30.47,45.2 30.77,44.91 30.8,44.88 30.8,44.53 31.08,44.25 31.43,44.25 31.75,43.92 | U$2.B20 47.27,54.05 46.8,54.53 46.8,54.92 46.9,55.02 46.9,57.7 46.19,58.41
  Top 0.406: C2.1 62.03,71.95 C6.1 64.02,68.68 JP1.2
  Top 0.61: U$4.P$1 64.09,76.31 C2.1 | C2.1 56.24,74.25 VDD_IO.1 | C2.1 46.19,58.41 v46.19,58.39
  Bottom 0.152: v52.24,38.45 52.24,33.04 49.99,30.79 47.35,30.79 v45.12,33.02 42.88,30.78 v40.96,30.78
  Bottom 0.406: v26.81,48.38 26.13,49.06 26.13,56.13 v27.96,57.96 28.39,58.39 v46.19,58.39 47.28,58.39 54.96,50.71 54.96,39.49 53.92,38.45 v52.24,38.45 | v52.24,38.45

## Text on the board
tNames: GND | VDD_CORE | GND | VDD_IO | RESET | LUT5_OUT_1 | GPIO3 | GPIO5 | GPIO0 | GPIO2 | GPIO1 | GND | PERF_SPYPAD_0 | GND | GND | LUT5_OUT_0 | CLK | GPIO4 | CC_SPYPAD_1 | TEST_EN | LUT6_OUT_0 | GPIO8 | GPIO9 | GPIO10 | GPIO11 | DO NOT OPERATE / WITHOUT CUSTOM / CLPD FIRMWARE | CC_SPYPAD_0 | GND | GPIO6 | GPIO7 | CC_SPYPAD_2 | LUT4_OUT_0 | LUT4_OUT_1 | SC_TAIL | LUT4_OUT_2 | CCFF_HEAD | SC_HEAD | COUT_SPYPAD_0 | GND | LUT4_OUT_3 | SHIFTREG_SPY | GPIO21 | CCFF_TAIL | GPIO19 | SC_SPYPAD | GPIO23 | GPIO18 | GPIO20 | GND | GPIO22 | PROG_CLK | GPIO15 | GPIO12 | GND | GND | PRESET | GPIO16 | GPIO17 | GPIO14 | GPIO13 | GF12nm testbed V2 | March 2021